# EAGLE schematic circuit (EAGLE 9.2.1)
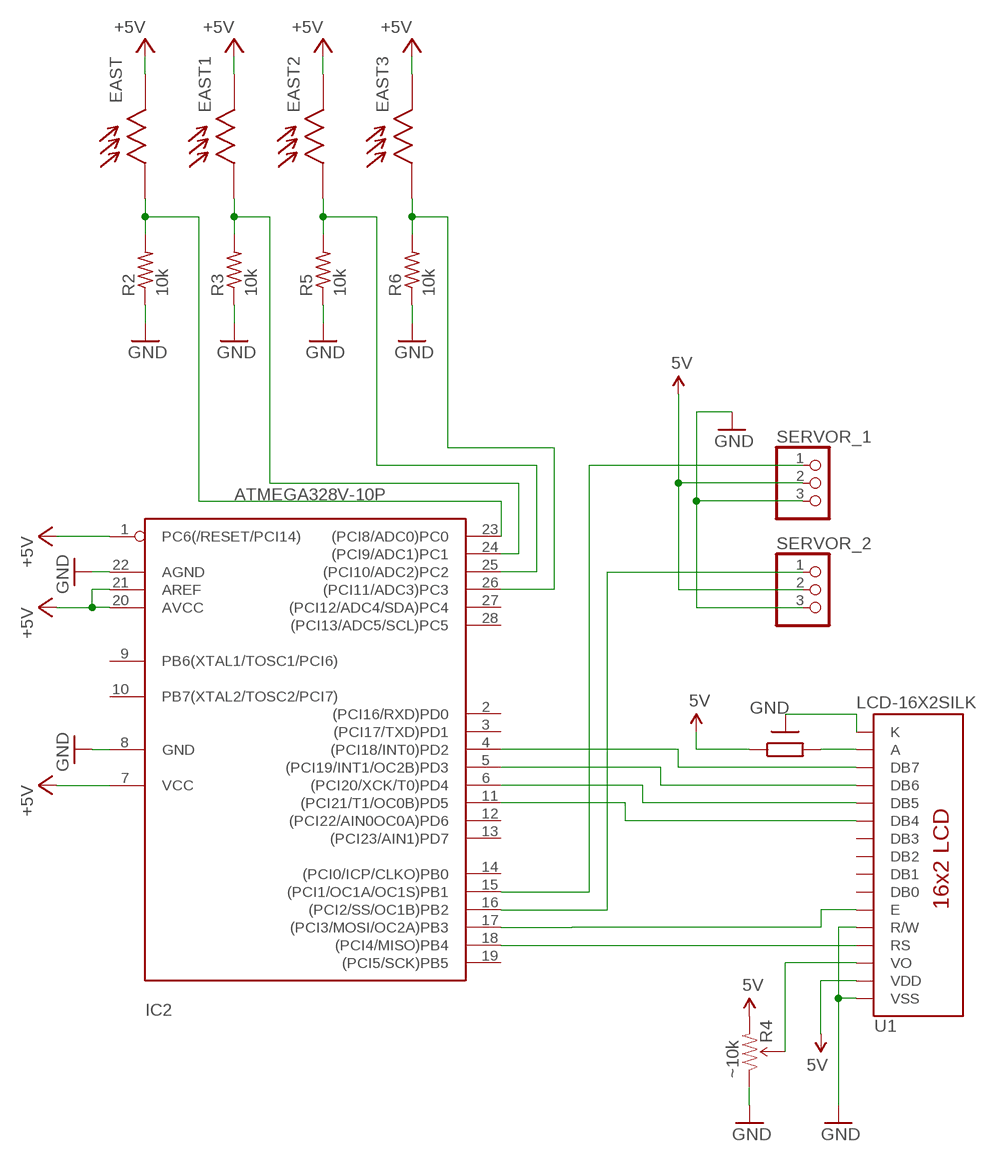
[diagram p0: schematic, sheet 1]

## Parts
EAST  CDSLDR3MM  [LDR3MM]
EAST1  CDSLDR3MM  [LDR3MM]
EAST2  CDSLDR3MM  [LDR3MM]
EAST3  CDSLDR3MM  [LDR3MM]
IC2  ATMEGA328V-10P  [DIL28-3]
R2  10k  R-US_0204/7  [0204/7]
R3  10k  R-US_0204/7  [0204/7]
R4  ~10k  TRIMPOT-PTH-KNOB  [3386U]
R5  10k  R-US_0204/7  [0204/7]
R6  10k  R-US_0204/7  [0204/7]
SERVOR_1  PINHD-1X3  [1X03]
SERVOR_2  PINHD-1X3  [1X03]
U1  LCD-16X2SILK  [LCD-16X2]

## Nets
5V: R4.3(CW) SERVOR_1.2 SERVOR_2.2 U1.2(VDD)
+5V: EAST1.P$2 EAST2.P$2 EAST3.P$2 EAST.P$2 IC2.1(PC6(/RESET/PCI14)) IC2.7(VCC) IC2.20(AVCC) IC2.21(AREF)
GND: IC2.8(GND) IC2.22(AGND) R2.1 R3.1 R4.1(CCW) R5.1 R6.1 SERVOR_1.3 SERVOR_2.3 U1.1(VSS) U1.5(R/W) U1.16(K)
N$1: R4.2(WIPER) U1.3(VO)
N$2: IC2.4((PCI18/INT0)PD2) U1.14(DB7)
N$3: U1.15(A)
N$4: IC2.16((PCI2/SS/OC1B)PB2) SERVOR_2.1
N$5: IC2.5((PCI19/INT1/OC2B)PD3) U1.13(DB6)
N$6: IC2.6((PCI20/XCK/T0)PD4) U1.12(DB5)
N$7: IC2.11((PCI21/T1/OC0B)PD5) U1.11(DB4)
N$8: IC2.15((PCI1/OC1A/OC1S)PB1) SERVOR_1.1
N$9: IC2.18((PCI4/MISO)PB4) U1.4(RS)
N$10: IC2.17((PCI3/MOSI/OC2A)PB3) U1.6(E)
N$11: EAST.P$1 IC2.23((PCI8/ADC0)PC0) R2.2
N$12: EAST1.P$1 IC2.24((PCI9/ADC1)PC1) R3.2
N$13: EAST2.P$1 IC2.25((PCI10/ADC2)PC2) R5.2
N$14: EAST3.P$1 IC2.26((PCI11/ADC3)PC3) R6.2
Unconnected: IC2.2((PCI16/RXD)PD0) IC2.3((PCI17/TXD)PD1) IC2.9(PB6(XTAL1/TOSC1/PCI6)) IC2.10(PB7(XTAL2/TOSC2/PCI7)) IC2.12((PCI22/AIN0OC0A)PD6) IC2.13((PCI23/AIN1)PD7) IC2.14((PCI0/ICP/CLKO)PB0) IC2.19((PCI5/SCK)PB5) IC2.27((PCI12/ADC4/SDA)PC4) IC2.28((PCI13/ADC5/SCL)PC5) U1.7(DB0) U1.8(DB1) U1.9(DB2) U1.10(DB3)

## Library data of the parts
EAST EAST1-EAST3 = CEDTv40:CDSLDR3MM
IC2 = atmega328:ATMEGA328*P: MICROCONTROLLER 32 kBytes FLASH 2 kBytes SRAM 1 kBytes EEPROM USART 8-channel 10 bit ADC
R2 R3 R5 R6 = adafruit:R-US_: RESISTOR, American symbol
R4 = SparkFun:TRIMPOT
SERVOR_1 SERVOR_2 = pinhead:PINHD-1X3: PIN HEADER
U1 = SparkFun:LCD-16X2

## Net classes
0 default: width 0.508 mm, drill 0.305 mm, clearance 0.254 mm